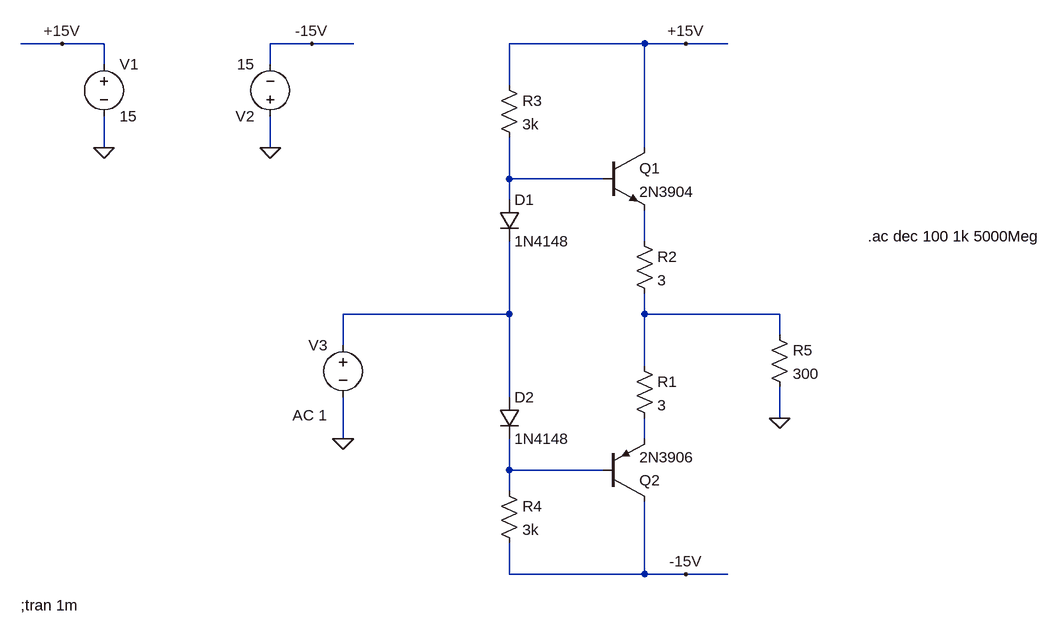
[diagram p0: schematic klasa_AB_ac_sim.asc]
klasa_AB_ac_sim.asc, the LTspice schematic file:
Version 4
SHEET 1 980 752
WIRE -544 -128 -608 -128
WIRE -480 -128 -544 -128
WIRE -160 -128 -224 -128
WIRE -96 -128 -160 -128
WIRE 352 -128 144 -128
WIRE 416 -128 352 -128
WIRE 480 -128 416 -128
WIRE -480 -96 -480 -128
WIRE -224 -96 -224 -128
WIRE 144 -64 144 -128
WIRE -480 32 -480 -16
WIRE -224 32 -224 -16
WIRE 352 32 352 -128
WIRE 144 80 144 16
WIRE 288 80 144 80
WIRE 144 112 144 80
WIRE 352 176 352 128
WIRE 144 288 144 176
WIRE 144 288 -112 288
WIRE 352 288 352 256
WIRE 560 288 352 288
WIRE 560 320 560 288
WIRE -112 336 -112 288
WIRE 352 368 352 288
WIRE 144 416 144 288
WIRE 560 448 560 400
WIRE -112 480 -112 416
WIRE 352 480 352 448
WIRE 144 528 144 480
WIRE 288 528 144 528
WIRE 144 560 144 528
WIRE 144 688 144 640
WIRE 352 688 352 576
WIRE 352 688 144 688
WIRE 416 688 352 688
WIRE 480 688 416 688
FLAG 416 -128 +15V
FLAG 416 688 -15V
FLAG -544 -128 +15V
FLAG -480 32 0
FLAG -224 32 0
FLAG -160 -128 -15V
FLAG 560 448 0
FLAG -112 480 0
SYMBOL npn 288 32 R0
SYMATTR InstName Q1
SYMATTR Value 2N3904
SYMBOL pnp 288 576 M180
SYMATTR InstName Q2
SYMATTR Value 2N3906
SYMBOL res 336 352 R0
SYMATTR InstName R1
SYMATTR Value 3
SYMBOL res 336 160 R0
SYMATTR InstName R2
SYMATTR Value 3
SYMBOL diode 128 112 R0
SYMATTR InstName D1
SYMATTR Value 1N4148
SYMBOL diode 128 416 R0
SYMATTR InstName D2
SYMATTR Value 1N4148
SYMBOL voltage -480 -112 R0
WINDOW 123 0 0 Left 0
WINDOW 39 0 0 Left 0
SYMATTR InstName V1
SYMATTR Value 15
SYMBOL voltage -224 0 R180
WINDOW 123 0 0 Left 0
WINDOW 39 0 0 Left 0
SYMATTR InstName V2
SYMATTR Value 15
SYMBOL res 128 -80 R0
SYMATTR InstName R3
SYMATTR Value 3k
SYMBOL res 128 544 R0
SYMATTR InstName R4
SYMATTR Value 3k
SYMBOL voltage -112 320 M0
WINDOW 123 24 124 Left 2
WINDOW 39 0 0 Left 0
SYMATTR Value2 AC 1
SYMATTR InstName V3
SYMATTR Value ""
SYMBOL res 544 304 R0
SYMATTR InstName R5
SYMATTR Value 300
TEXT -608 736 Left 2 !;tran 1m
TEXT 696 168 Left 2 !.ac dec 100 1k 5000Meg

The netlist it stands for:
* klasa_AB_ac_sim.asc
Q1 +15V N001 N002 0 2N3904
Q2 -15V N006 N005 0 2N3906
R1 N004 N005 3
R2 N002 N004 3
D1 N001 N003 1N4148
D2 N003 N006 1N4148
V1 +15V 0 15
V2 0 -15V 15
R3 +15V N001 3k
R4 N006 -15V 3k
V3 N003 0 AC 1
R5 N004 0 300
.model D D
.lib standard.dio
.model NPN NPN
.model PNP PNP
.lib standard.bjt
;tran 1m
.ac dec 100 1k 5000Meg
.backanno
.end